# Altium schematic sheet ADC_Filter.SchDoc
size A4; DocumentNumber: 4; SheetNumber: 4; SheetTotal: 9
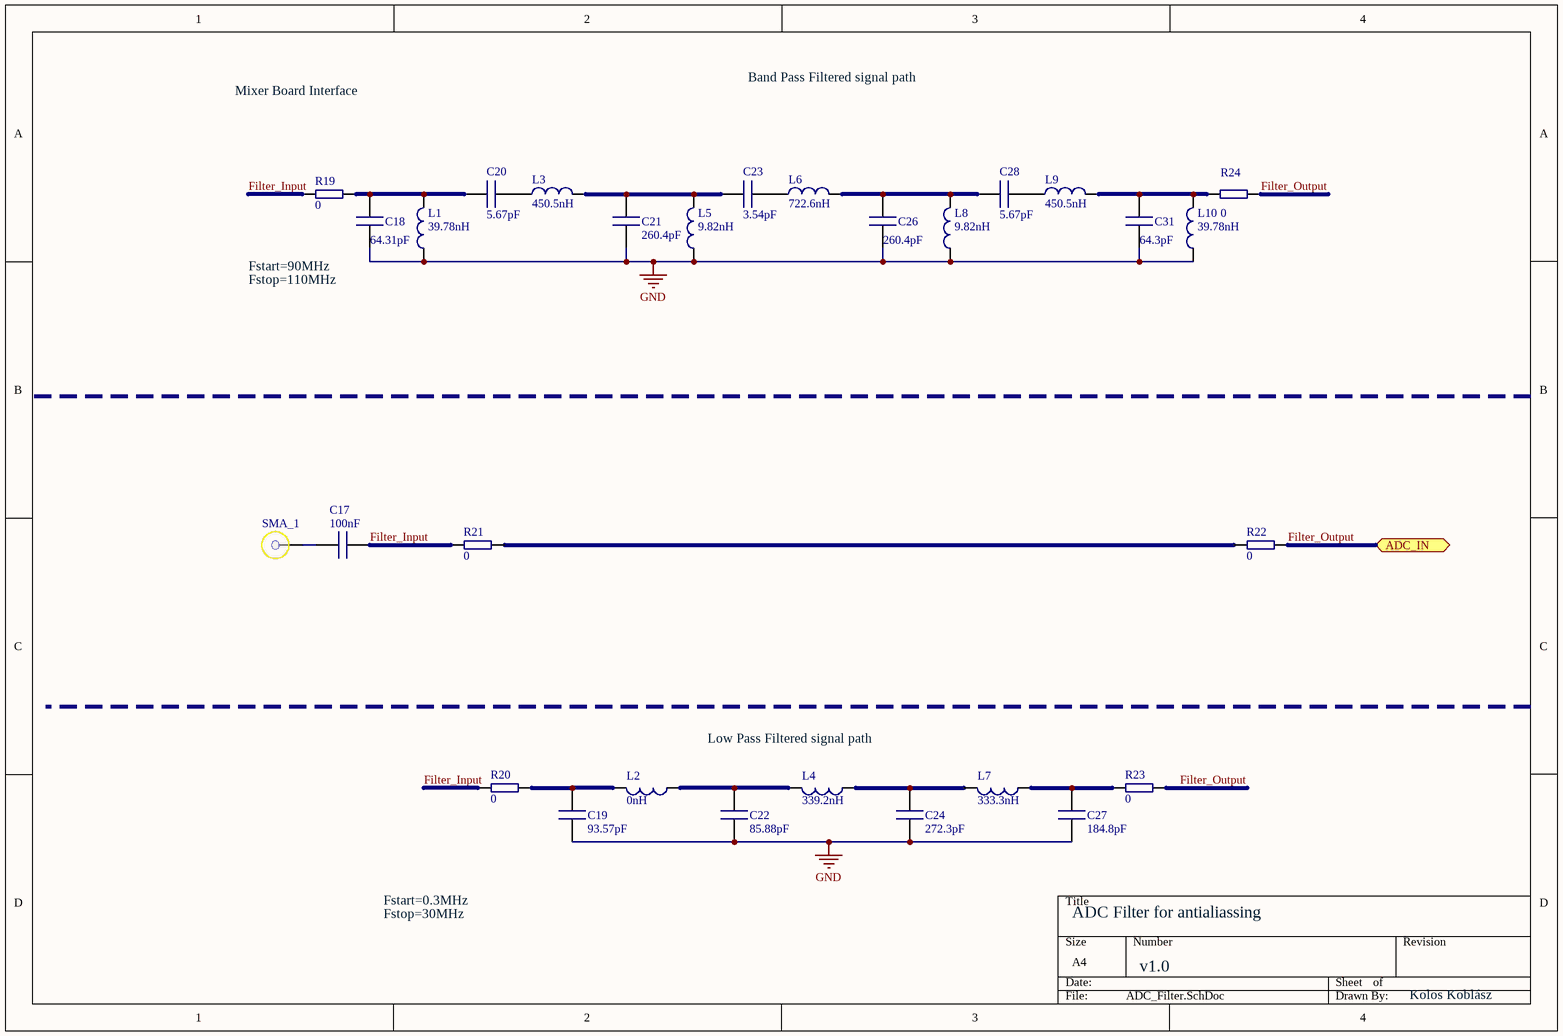
[diagram p0: ADC_Filter.SchDoc]

## Parts
C17  value 100nF  [0805 SMD Passive]  (hidden comment: Cap1)
C18  value 64.31pF  [0805 SMD Passive]  (hidden comment: Cap1)
C19  value 93.57pF  [0805 SMD Passive]  (hidden comment: Cap1)
C20  value 5.67pF  [0805 SMD Passive]  (hidden comment: Cap1)
C21  value 260.4pF  [0805 SMD Passive]  (hidden comment: Cap1)
C22  value 85.88pF  [0805 SMD Passive]  (hidden comment: Cap1)
C23  value 3.54pF  [0805 SMD Passive]  (hidden comment: Cap1)
C24  value 272.3pF  [0805 SMD Passive]  (hidden comment: Cap1)
C26  value 260.4pF  [0805 SMD Passive]  (hidden comment: Cap1)
C27  value 184.8pF  [0805 SMD Passive]  (hidden comment: Cap1)
C28  value 5.67pF  [0805 SMD Passive]  (hidden comment: Cap1)
C31  value 64.3pF  [0805 SMD Passive]  (hidden comment: Cap1)
L1  value 39.78nH  [0805 SMD Passive]  (hidden comment: Inductor)
L2  value 0nH  [0805 SMD Passive]  (hidden comment: Inductor)
L3  value 450.5nH  [0805 SMD Passive]  (hidden comment: Inductor)
L4  value 339.2nH  [0805 SMD Passive]  (hidden comment: Inductor)
L5  value 9.82nH  [0805 SMD Passive]  (hidden comment: Inductor)
L6  value 722.6nH  [0805 SMD Passive]  (hidden comment: Inductor)
L7  value 333.3nH  [0805 SMD Passive]  (hidden comment: Inductor)
L8  value 9.82nH  [0805 SMD Passive]  (hidden comment: Inductor)
L9  value 450.5nH  [0805 SMD Passive]  (hidden comment: Inductor)
L10  value 39.78nH  [0805 SMD Passive]  (hidden comment: Inductor)
R19  value 0  [0805 SMD Passive]  (hidden comment: Resistor)
R20  value 0  [0805 SMD Passive]  (hidden comment: Resistor)
R21  value 0  [0805 SMD Passive]  (hidden comment: Resistor)
R22  value 0  [0805 SMD Passive]  (hidden comment: Resistor)
R23  value 0  [0805 SMD Passive]  (hidden comment: Resistor)
R24  value 0  [0805 SMD Passive]  (hidden comment: Resistor)
SMA_1  SMA1  [SMA Flange]  (value not drawn)

## Ports
ADC_IN

## Nets
GND: C18.2 C19.1 C21.2 C22.1 C24.1 C26.2 C27.1 C31.2 L1.1 L5.1 L8.1 L10.1
Filter_Input: C17.1 R19.2 R20.2 R21.2
Filter_Output: R22.1 R23.1 R24.1 ; port ADC_IN
NetC17_2: C17.2 SMA_1.1
NetC18_1: C18.1 C20.1 L1.2 R19.1
NetC19_2: C19.2 L2.2 R20.1
NetC20_2: C20.2 L3.1
NetC21_1: C21.1 C23.1 L3.2 L5.2
NetC22_2: C22.2 L2.1 L4.2
NetC23_2: C23.2 L6.1
NetC24_2: C24.2 L4.1 L7.2
NetC26_1: C26.1 C28.1 L6.2 L8.2
NetC27_2: C27.2 L7.1 R23.2
NetC28_2: C28.2 L9.1
NetC31_1: C31.1 L9.2 L10.2 R24.2
NetR21_1: R21.1 R22.2

## Notes on the sheet
- Mixer Board Interface
- Band Pass Filtered signal path
- Fstart=90MHz
- Fstop=110MHz
- Low Pass Filtered signal path
- Fstart=0.3MHz
- Fstop=30MHz
- ADC Filter for antialiassing
- v1.0
- Kolos Koblász

## Library data of the parts
C17-C24 C26-C28 C31 = Cap1: SMD Capacitor; Precision: 1%; MaxVolt: 16V; FootPrint: *
L1-L10 = Ind1: SMD Inductor; Precision: 10%; MaxCurent: 100mA; FootPrint: SMD
R19-R24 = Res1: SMD Resistor; Precision: 1%; MaxPower: 0.1W; FootPrint: SMD
SMA_1 = SMA1: SMA Female; Shape: Straight; Footprint: *; PartNumber: *; Manufacturer: *; OrderCode: *; Mounting: TroughHole